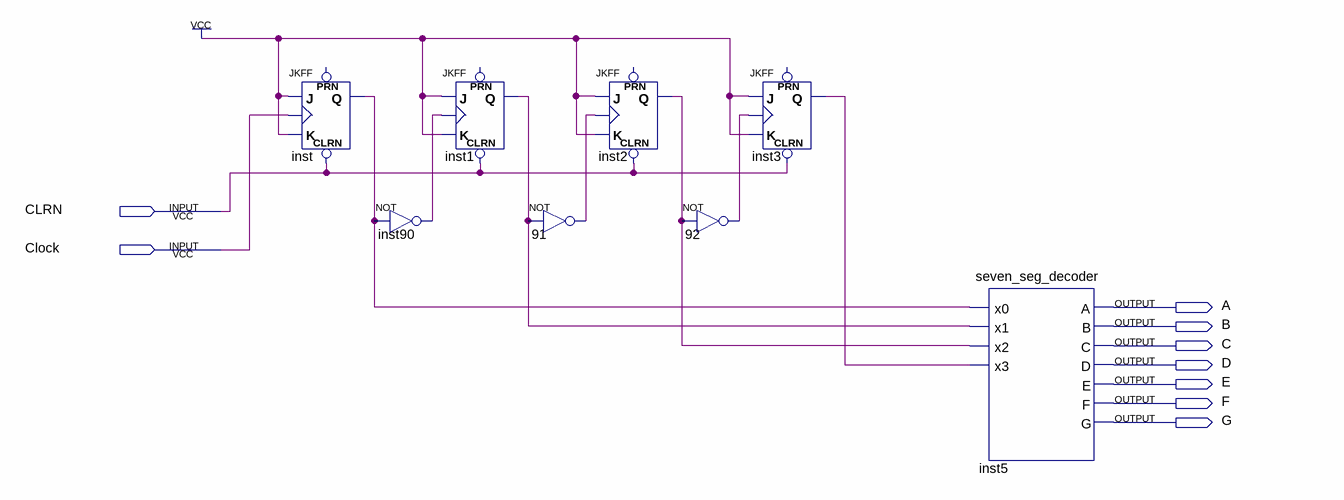
[diagram p0: schematic sheet]
// Quartus schematic lab10step3a.bdf as structural Verilog: 8 symbols, 9 pins
module lab10step3a (
  input  CLRN,
  input  Clock,
  output A,
  output B,
  output C,
  output D,
  output E,
  output F,
  output G
);

  wire inst1_q, inst2_q, inst3_q, inst90_out, inst_q, n91_out, n92_out;

  JKFF inst (.CLRN(CLRN), .K(1'b1), .J(1'b1), .CLK(Clock), .Q(inst_q));  // open: PRN
  not inst90 (inst90_out, inst_q);
  JKFF inst1 (.CLRN(CLRN), .K(1'b1), .J(1'b1), .CLK(inst90_out), .Q(inst1_q));  // open: PRN
  not u_91 (n91_out, inst1_q);
  JKFF inst2 (.CLRN(CLRN), .K(1'b1), .J(1'b1), .CLK(n91_out), .Q(inst2_q));  // open: PRN
  not u_92 (n92_out, inst2_q);
  JKFF inst3 (.CLRN(CLRN), .K(1'b1), .J(1'b1), .CLK(n92_out), .Q(inst3_q));  // open: PRN
  seven_seg_decoder inst5 (
    .x0(inst_q), .x1(inst1_q), .x2(inst2_q), .x3(inst3_q), .A(A), .B(B), .C(C), .D(D), .E(E), .F(F), .G(G));
endmodule
